# Altium schematic sheet Key_Matrix.SchDoc
size A
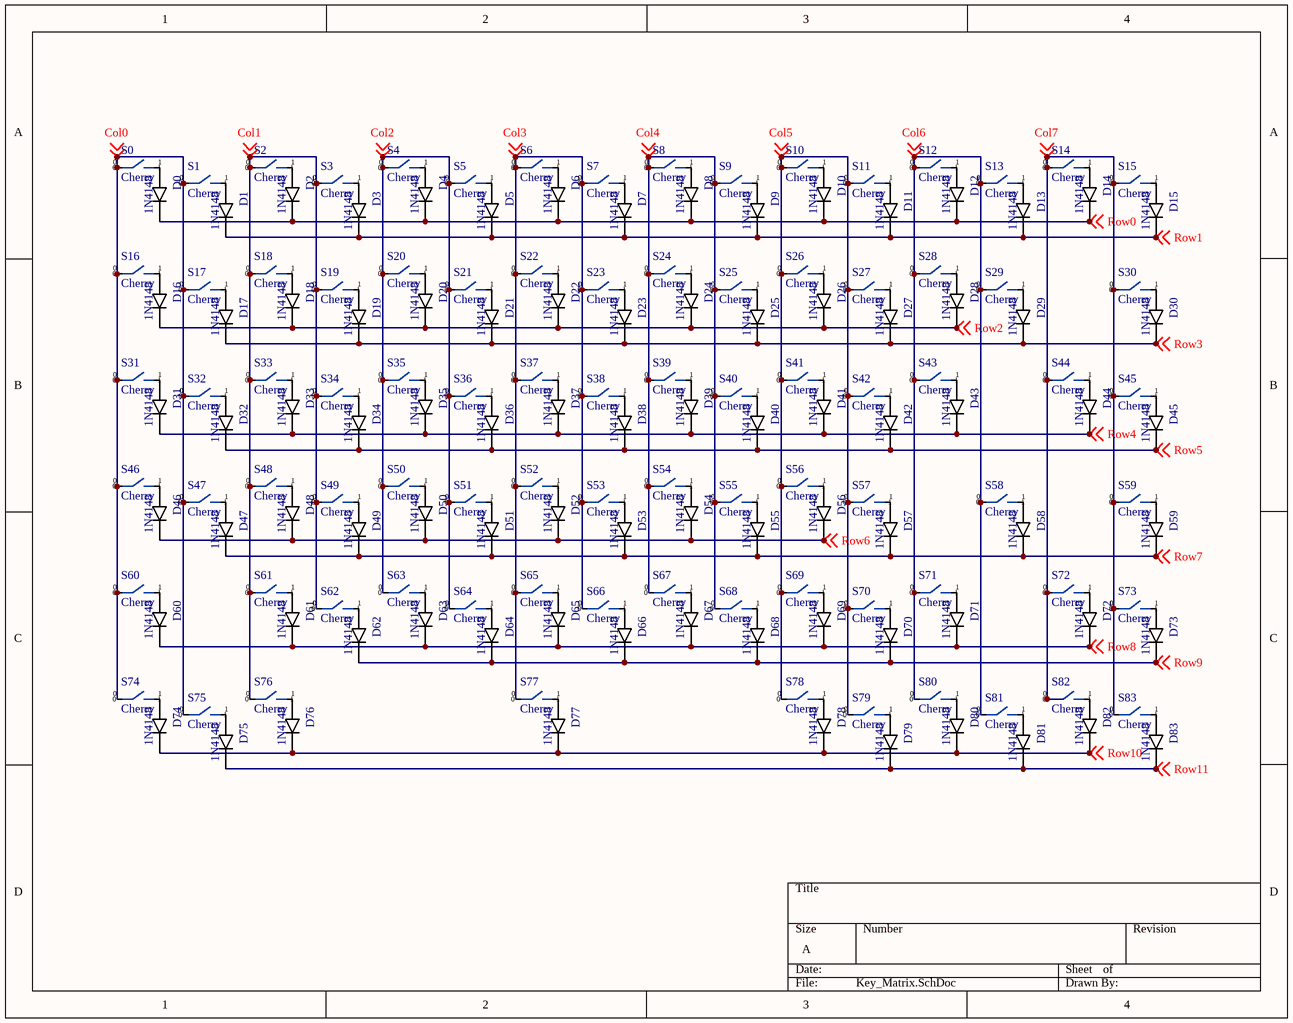
[diagram p0: Key_Matrix.SchDoc]

## Parts
D0  1N4148  [DIOAD829W49L456D191_1N4148(Primary)]
D1  1N4148  [DIOAD829W49L456D191_1N4148(Primary)]
D2  1N4148  [DIOAD829W49L456D191_1N4148(Primary)]
D3  1N4148  [DIOAD829W49L456D191_1N4148(Primary)]
D4  1N4148  [DIOAD829W49L456D191_1N4148(Primary)]
D5  1N4148  [DIOAD829W49L456D191_1N4148(Primary)]
D6  1N4148  [DIOAD829W49L456D191_1N4148(Primary)]
D7  1N4148  [DIOAD829W49L456D191_1N4148(Primary)]
D8  1N4148  [DIOAD829W49L456D191_1N4148(Primary)]
D9  1N4148  [DIOAD829W49L456D191_1N4148(Primary)]
D10  1N4148  [DIOAD829W49L456D191_1N4148(Primary)]
D11  1N4148  [DIOAD829W49L456D191_1N4148(Primary)]
D12  1N4148  [DIOAD829W49L456D191_1N4148(Primary)]
D13  1N4148  [DIOAD829W49L456D191_1N4148(Primary)]
D14  1N4148  [DIOAD829W49L456D191_1N4148(Primary)]
D15  1N4148  [DIOAD829W49L456D191_1N4148(Primary)]
D16  1N4148  [DIOAD829W49L456D191_1N4148(Primary)]
D17  1N4148  [DIOAD829W49L456D191_1N4148(Primary)]
D18  1N4148  [DIOAD829W49L456D191_1N4148(Primary)]
D19  1N4148  [DIOAD829W49L456D191_1N4148(Primary)]
D20  1N4148  [DIOAD829W49L456D191_1N4148(Primary)]
D21  1N4148  [DIOAD829W49L456D191_1N4148(Primary)]
D22  1N4148  [DIOAD829W49L456D191_1N4148(Primary)]
D23  1N4148  [DIOAD829W49L456D191_1N4148(Primary)]
D24  1N4148  [DIOAD829W49L456D191_1N4148(Primary)]
D25  1N4148  [DIOAD829W49L456D191_1N4148(Primary)]
D26  1N4148  [DIOAD829W49L456D191_1N4148(Primary)]
D27  1N4148  [DIOAD829W49L456D191_1N4148(Primary)]
D28  1N4148  [DIOAD829W49L456D191_1N4148(Primary)]
D29  1N4148  [DIOAD829W49L456D191_1N4148(Primary)]
D30  1N4148  [DIOAD829W49L456D191_1N4148(Primary)]
D31  1N4148  [DIOAD829W49L456D191_1N4148(Primary)]
D32  1N4148  [DIOAD829W49L456D191_1N4148(Primary)]
D33  1N4148  [DIOAD829W49L456D191_1N4148(Primary)]
D34  1N4148  [DIOAD829W49L456D191_1N4148(Primary)]
D35  1N4148  [DIOAD829W49L456D191_1N4148(Primary)]
D36  1N4148  [DIOAD829W49L456D191_1N4148(Primary)]
D37  1N4148  [DIOAD829W49L456D191_1N4148(Primary)]
D38  1N4148  [DIOAD829W49L456D191_1N4148(Primary)]
D39  1N4148  [DIOAD829W49L456D191_1N4148(Primary)]
D40  1N4148  [DIOAD829W49L456D191_1N4148(Primary)]
D41  1N4148  [DIOAD829W49L456D191_1N4148(Primary)]
D42  1N4148  [DIOAD829W49L456D191_1N4148(Primary)]
D43  1N4148  [DIOAD829W49L456D191_1N4148(Primary)]
D44  1N4148  [DIOAD829W49L456D191_1N4148(Primary)]
D45  1N4148  [DIOAD829W49L456D191_1N4148(Primary)]
D46  1N4148  [DIOAD829W49L456D191_1N4148(Primary)]
D47  1N4148  [DIOAD829W49L456D191_1N4148(Primary)]
D48  1N4148  [DIOAD829W49L456D191_1N4148(Primary)]
D49  1N4148  [DIOAD829W49L456D191_1N4148(Primary)]
D50  1N4148  [DIOAD829W49L456D191_1N4148(Primary)]
D51  1N4148  [DIOAD829W49L456D191_1N4148(Primary)]
D52  1N4148  [DIOAD829W49L456D191_1N4148(Primary)]
D53  1N4148  [DIOAD829W49L456D191_1N4148(Primary)]
D54  1N4148  [DIOAD829W49L456D191_1N4148(Primary)]
D55  1N4148  [DIOAD829W49L456D191_1N4148(Primary)]
D56  1N4148  [DIOAD829W49L456D191_1N4148(Primary)]
D57  1N4148  [DIOAD829W49L456D191_1N4148(Primary)]
D58  1N4148  [DIOAD829W49L456D191_1N4148(Primary)]
D59  1N4148  [DIOAD829W49L456D191_1N4148(Primary)]
D60  1N4148  [DIOAD829W49L456D191_1N4148(Primary)]
D61  1N4148  [DIOAD829W49L456D191_1N4148(Primary)]
D62  1N4148  [DIOAD829W49L456D191_1N4148(Primary)]
D63  1N4148  [DIOAD829W49L456D191_1N4148(Primary)]
D64  1N4148  [DIOAD829W49L456D191_1N4148(Primary)]
D65  1N4148  [DIOAD829W49L456D191_1N4148(Primary)]
D66  1N4148  [DIOAD829W49L456D191_1N4148(Primary)]
D67  1N4148  [DIOAD829W49L456D191_1N4148(Primary)]
D68  1N4148  [DIOAD829W49L456D191_1N4148(Primary)]
D69  1N4148  [DIOAD829W49L456D191_1N4148(Primary)]
D70  1N4148  [DIOAD829W49L456D191_1N4148(Primary)]
D71  1N4148  [DIOAD829W49L456D191_1N4148(Primary)]
D72  1N4148  [DIOAD829W49L456D191_1N4148(Primary)]
D73  1N4148  [DIOAD829W49L456D191_1N4148(Primary)]
D74  1N4148  [DIOAD829W49L456D191_1N4148(Primary)]
D75  1N4148  [DIOAD829W49L456D191_1N4148(Primary)]
D76  1N4148  [DIOAD829W49L456D191_1N4148(Primary)]
D77  1N4148  [DIOAD829W49L456D191_1N4148(Primary)]
D78  1N4148  [DIOAD829W49L456D191_1N4148(Primary)]
D79  1N4148  [DIOAD829W49L456D191_1N4148(Primary)]
D80  1N4148  [DIOAD829W49L456D191_1N4148(Primary)]
D81  1N4148  [DIOAD829W49L456D191_1N4148(Primary)]
D82  1N4148  [DIOAD829W49L456D191_1N4148(Primary)]
D83  1N4148  [DIOAD829W49L456D191_1N4148(Primary)]
S0  Cherry  [CHERRY-MX-LED-1U]
S1  Cherry  [CHERRY-MX-LED-1U]
S2  Cherry  [CHERRY-MX-LED-1U]
S3  Cherry  [CHERRY-MX-LED-1U]
S4  Cherry  [CHERRY-MX-LED-1U]
S5  Cherry  [CHERRY-MX-LED-1U]
S6  Cherry  [CHERRY-MX-LED-1U]
S7  Cherry  [CHERRY-MX-LED-1U]
S8  Cherry  [CHERRY-MX-LED-1U]
S9  Cherry  [CHERRY-MX-LED-1U]
S10  Cherry  [CHERRY-MX-LED-1U]
S11  Cherry  [CHERRY-MX-LED-1U]
S12  Cherry  [CHERRY-MX-LED-1U]
S13  Cherry  [CHERRY-MX-LED-1U]
S14  Cherry  [CHERRY-MX-LED-1U]
S15  Cherry  [CHERRY-MX-LED-1U]
S16  Cherry  [CHERRY-MX-LED-1U]
S17  Cherry  [CHERRY-MX-LED-1U]
S18  Cherry  [CHERRY-MX-LED-1U]
S19  Cherry  [CHERRY-MX-LED-1U]
S20  Cherry  [CHERRY-MX-LED-1U]
S21  Cherry  [CHERRY-MX-LED-1U]
S22  Cherry  [CHERRY-MX-LED-1U]
S23  Cherry  [CHERRY-MX-LED-1U]
S24  Cherry  [CHERRY-MX-LED-1U]
S25  Cherry  [CHERRY-MX-LED-1U]
S26  Cherry  [CHERRY-MX-LED-1U]
S27  Cherry  [CHERRY-MX-LED-1U]
S28  Cherry  [CHERRY-MX-LED-1U]
S29  Cherry  [CHERRY-MX-LED-1U]
S30  Cherry  [CHERRY-MX-LED-1U]
S31  Cherry  [CHERRY-MX-LED-1U]
S32  Cherry  [CHERRY-MX-LED-1U]
S33  Cherry  [CHERRY-MX-LED-1U]
S34  Cherry  [CHERRY-MX-LED-1U]
S35  Cherry  [CHERRY-MX-LED-1U]
S36  Cherry  [CHERRY-MX-LED-1U]
S37  Cherry  [CHERRY-MX-LED-1U]
S38  Cherry  [CHERRY-MX-LED-1U]
S39  Cherry  [CHERRY-MX-LED-1U]
S40  Cherry  [CHERRY-MX-LED-1U]
S41  Cherry  [CHERRY-MX-LED-1U]
S42  Cherry  [CHERRY-MX-LED-1U]
S43  Cherry  [CHERRY-MX-LED-1U]
S44  Cherry  [CHERRY-MX-LED-1U]
S45  Cherry  [CHERRY-MX-LED-1U]
S46  Cherry  [CHERRY-MX-LED-1U]
S47  Cherry  [CHERRY-MX-LED-1U]
S48  Cherry  [CHERRY-MX-LED-1U]
S49  Cherry  [CHERRY-MX-LED-1U]
S50  Cherry  [CHERRY-MX-LED-1U]
S51  Cherry  [CHERRY-MX-LED-1U]
S52  Cherry  [CHERRY-MX-LED-1U]
S53  Cherry  [CHERRY-MX-LED-1U]
S54  Cherry  [CHERRY-MX-LED-1U]
S55  Cherry  [CHERRY-MX-LED-1U]
S56  Cherry  [CHERRY-MX-LED-1U]
S57  Cherry  [CHERRY-MX-LED-1U]
S58  Cherry  [CHERRY-MX-LED-1U]
S59  Cherry  [CHERRY-MX-LED-1U]
S60  Cherry  [CHERRY-MX-LED-1U]
S61  Cherry  [CHERRY-MX-LED-1U]
S62  Cherry  [CHERRY-MX-LED-1U]
S63  Cherry  [CHERRY-MX-LED-1U]
S64  Cherry  [CHERRY-MX-LED-1U]
S65  Cherry  [CHERRY-MX-LED-1U]
S66  Cherry  [CHERRY-MX-LED-1U]
S67  Cherry  [CHERRY-MX-LED-1U]
S68  Cherry  [CHERRY-MX-LED-1U]
S69  Cherry  [CHERRY-MX-LED-1U]
S70  Cherry  [CHERRY-MX-LED-1U]
S71  Cherry  [CHERRY-MX-LED-1U]
S72  Cherry  [CHERRY-MX-LED-1U]
S73  Cherry  [CHERRY-MX-LED-1U]
S74  Cherry  [CHERRY-MX-LED-1U]
S75  Cherry  [CHERRY-MX-LED-1U]
S76  Cherry  [CHERRY-MX-LED-1U]
S77  Cherry  [CHERRY-MX-LED-1U]
S78  Cherry  [CHERRY-MX-LED-1U]
S79  Cherry  [CHERRY-MX-LED-1U]
S80  Cherry  [CHERRY-MX-LED-1U]
S81  Cherry  [CHERRY-MX-LED-1U]
S82  Cherry  [CHERRY-MX-LED-1U]
S83  Cherry  [CHERRY-MX-LED-1U]

## Nets
Col0: S0.0 S1.0 S16.0 S17.0 S31.0 S32.0 S46.0 S47.0 S60.0 S74.0 S75.0 ; off-sheet Col0
Col1: S2.0 S3.0 S18.0 S19.0 S33.0 S34.0 S48.0 S49.0 S61.0 S62.0 S76.0 ; off-sheet Col1
Col2: S4.0 S5.0 S20.0 S21.0 S35.0 S36.0 S50.0 S51.0 S63.0 S64.0 ; off-sheet Col2
Col3: S6.0 S7.0 S22.0 S23.0 S37.0 S38.0 S52.0 S53.0 S65.0 S66.0 S77.0 ; off-sheet Col3
Col4: S8.0 S9.0 S24.0 S25.0 S39.0 S40.0 S54.0 S55.0 S67.0 S68.0 ; off-sheet Col4
Col5: S10.0 S11.0 S26.0 S27.0 S41.0 S42.0 S56.0 S57.0 S69.0 S70.0 S78.0 S79.0 ; off-sheet Col5
Col6: S12.0 S13.0 S28.0 S29.0 S43.0 S58.0 S71.0 S80.0 S81.0 ; off-sheet Col6
Col7: S14.0 S15.0 S30.0 S44.0 S45.0 S59.0 S72.0 S73.0 S82.0 S83.0 ; off-sheet Col7
Row0: D0.C D2.C D4.C D6.C D8.C D10.C D12.C D14.C ; off-sheet Row0
Row1: D1.C D3.C D5.C D7.C D9.C D11.C D13.C D15.C ; off-sheet Row1
Row2: D16.C D18.C D20.C D22.C D24.C D26.C D28.C ; off-sheet Row2
Row3: D17.C D19.C D21.C D23.C D25.C D27.C D29.C D30.C ; off-sheet Row3
Row4: D31.C D33.C D35.C D37.C D39.C D41.C D43.C D44.C ; off-sheet Row4
Row5: D32.C D34.C D36.C D38.C D40.C D42.C D45.C ; off-sheet Row5
Row6: D46.C D48.C D50.C D52.C D54.C D56.C ; off-sheet Row6
Row7: D47.C D49.C D51.C D53.C D55.C D57.C D58.C D59.C ; off-sheet Row7
Row8: D60.C D61.C D63.C D65.C D67.C D69.C D71.C D72.C ; off-sheet Row8
Row9: D62.C D64.C D66.C D68.C D70.C D73.C ; off-sheet Row9
Row10: D74.C D76.C D77.C D78.C D80.C D82.C ; off-sheet Row10
Row11: D75.C D79.C D81.C D83.C ; off-sheet Row11
NetD0_A: D0.A S0.1
NetD1_A: D1.A S1.1
NetD2_A: D2.A S2.1
NetD3_A: D3.A S3.1
NetD4_A: D4.A S4.1
NetD5_A: D5.A S5.1
NetD6_A: D6.A S6.1
NetD7_A: D7.A S7.1
NetD8_A: D8.A S8.1
NetD9_A: D9.A S9.1
NetD10_A: D10.A S10.1
NetD11_A: D11.A S11.1
NetD12_A: D12.A S12.1
NetD13_A: D13.A S13.1
NetD14_A: D14.A S14.1
NetD15_A: D15.A S15.1
NetD16_A: D16.A S16.1
NetD17_A: D17.A S17.1
NetD18_A: D18.A S18.1
NetD19_A: D19.A S19.1
NetD20_A: D20.A S20.1
NetD21_A: D21.A S21.1
NetD22_A: D22.A S22.1
NetD23_A: D23.A S23.1
NetD24_A: D24.A S24.1
NetD25_A: D25.A S25.1
NetD26_A: D26.A S26.1
NetD27_A: D27.A S27.1
NetD28_A: D28.A S28.1
NetD29_A: D29.A S29.1
NetD30_A: D30.A S30.1
NetD31_A: D31.A S31.1
NetD32_A: D32.A S32.1
NetD33_A: D33.A S33.1
NetD34_A: D34.A S34.1
NetD35_A: D35.A S35.1
NetD36_A: D36.A S36.1
NetD37_A: D37.A S37.1
NetD38_A: D38.A S38.1
NetD39_A: D39.A S39.1
NetD40_A: D40.A S40.1
NetD41_A: D41.A S41.1
NetD42_A: D42.A S42.1
NetD43_A: D43.A S43.1
NetD44_A: D44.A S44.1
NetD45_A: D45.A S45.1
NetD46_A: D46.A S46.1
NetD47_A: D47.A S47.1
NetD48_A: D48.A S48.1
NetD49_A: D49.A S49.1
NetD50_A: D50.A S50.1
NetD51_A: D51.A S51.1
NetD52_A: D52.A S52.1
NetD53_A: D53.A S53.1
NetD54_A: D54.A S54.1
NetD55_A: D55.A S55.1
NetD56_A: D56.A S56.1
NetD57_A: D57.A S57.1
NetD58_A: D58.A S58.1
NetD59_A: D59.A S59.1
NetD60_A: D60.A S60.1
NetD61_A: D61.A S61.1
NetD62_A: D62.A S62.1
NetD63_A: D63.A S63.1
NetD64_A: D64.A S64.1
NetD65_A: D65.A S65.1
NetD66_A: D66.A S66.1
NetD67_A: D67.A S67.1
NetD68_A: D68.A S68.1
NetD69_A: D69.A S69.1
NetD70_A: D70.A S70.1
NetD71_A: D71.A S71.1
NetD72_A: D72.A S72.1
NetD73_A: D73.A S73.1
NetD74_A: D74.A S74.1
NetD75_A: D75.A S75.1
NetD76_A: D76.A S76.1
NetD77_A: D77.A S77.1
NetD78_A: D78.A S78.1
NetD79_A: D79.A S79.1
NetD80_A: D80.A S80.1
NetD81_A: D81.A S81.1
NetD82_A: D82.A S82.1
NetD83_A: D83.A S83.1

## Library data of the parts
D0-D83 = 1N4148: Diode Small Signal Switching 100V 0.3A 2-Pin DO-35; MF: MICROSS/On Semiconductor; Package: DO-35 Vishay; Availability: Unavailable; MP: 1N4148; SnapEDA_Link: https://www.snapeda.com/parts/1N4148/MICROSS/On%20Semiconductor/view-part/?ref=snap; Price: None; Value: *
S0-S83 = Cherry_Switch: Cherry SPST Keyswitch